# EAGLE design SmartEVSEv2.2 (EAGLE 6.6.0)
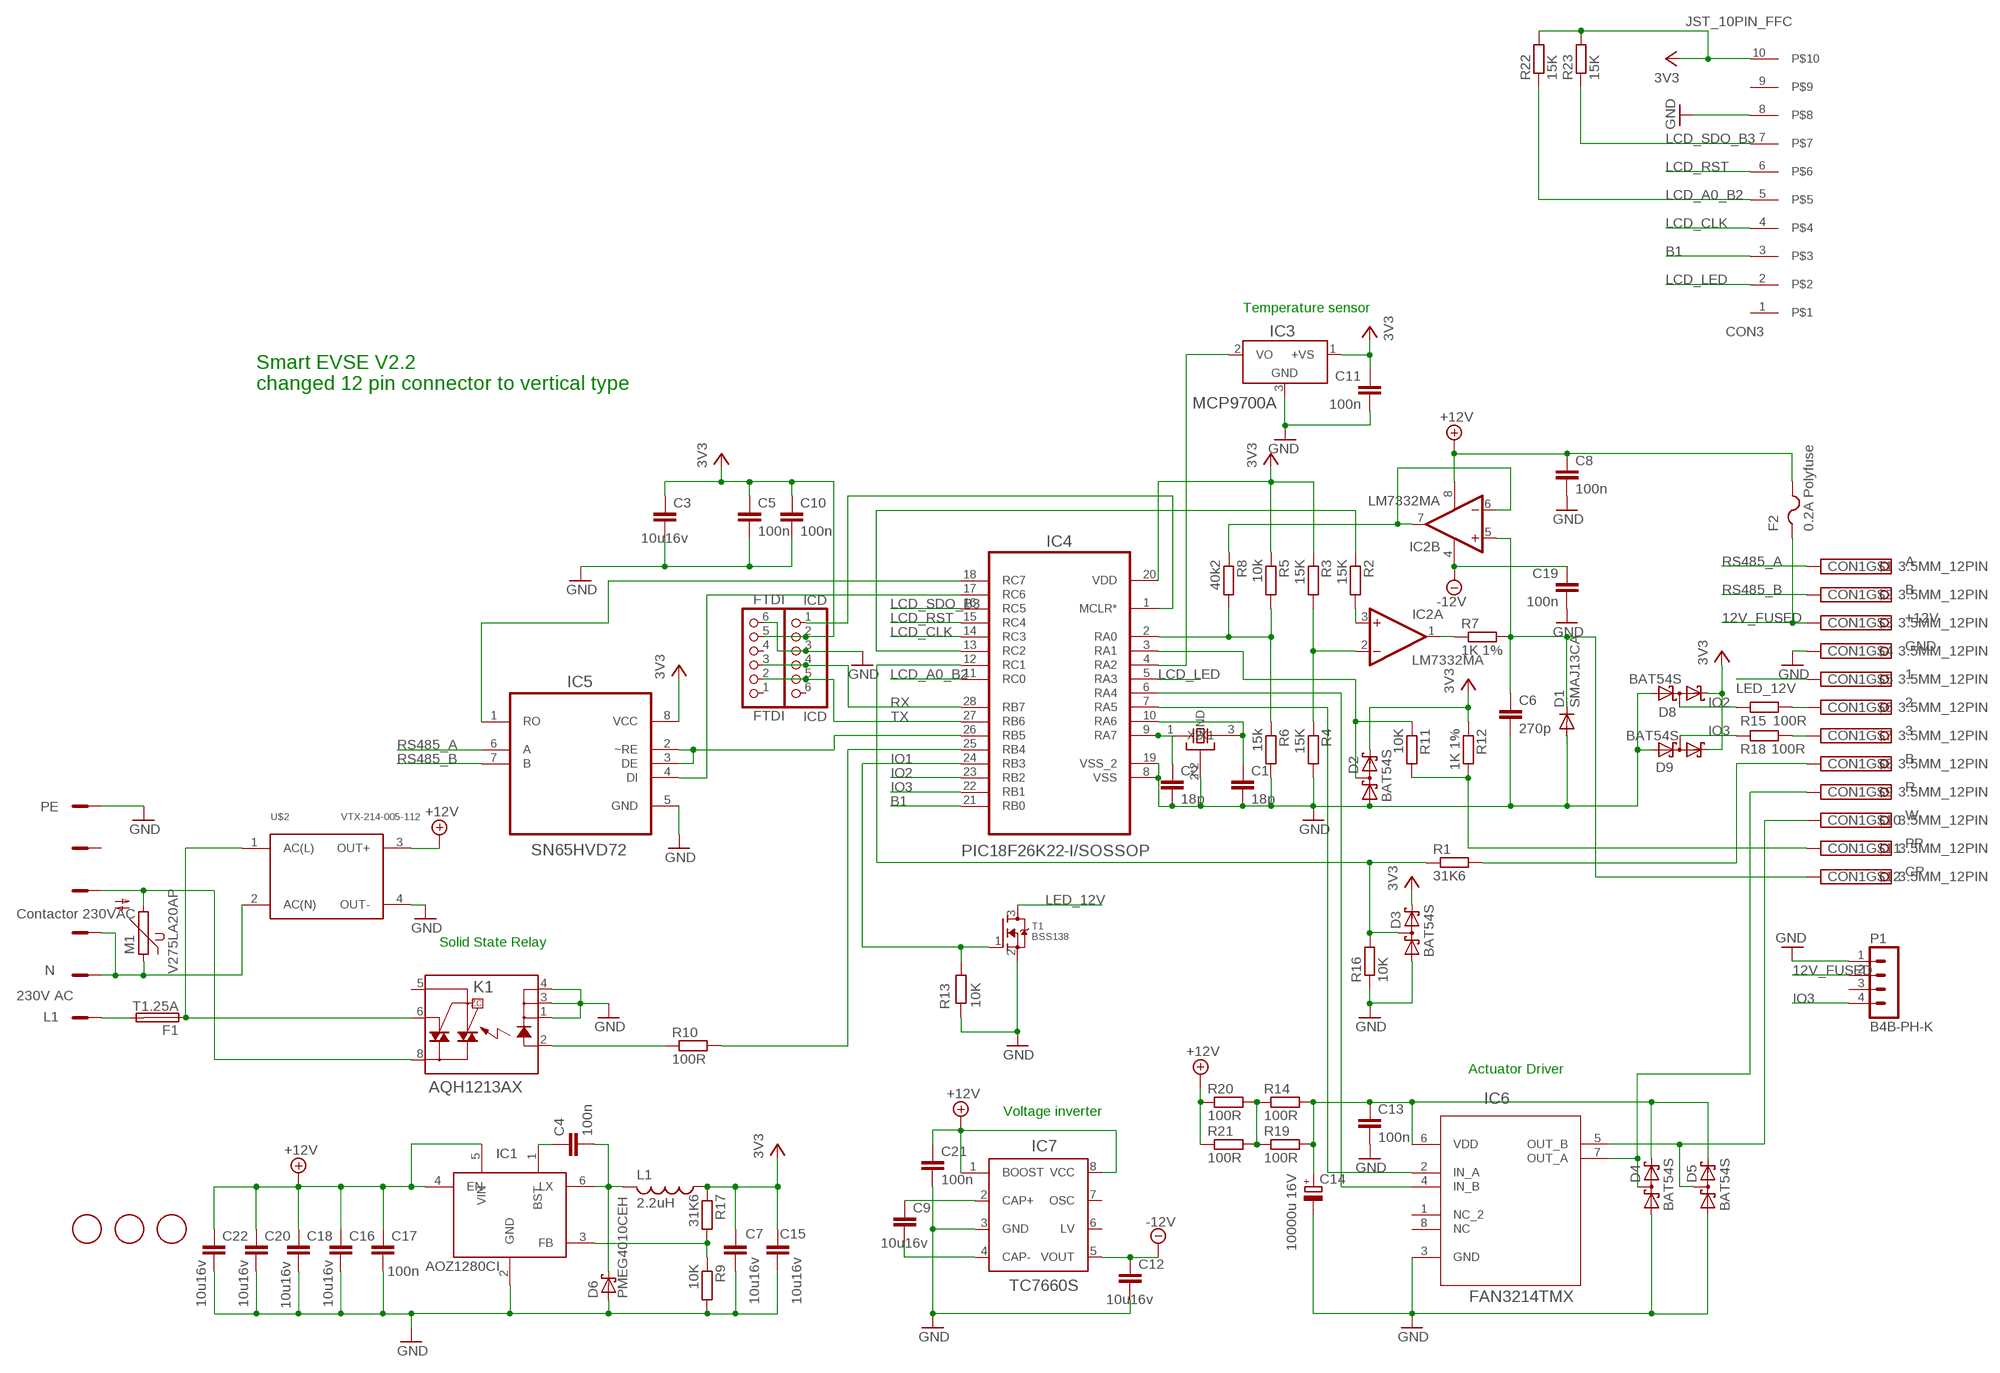
[diagram p0: schematic, sheet 1]

## Parts
C1  18p  C-EUC0603  [C0603]
C2  18p  C-EUC0603  [C0603]
C3  10u16v  C-EUC0805  [C0805]
C4  100n  C-EUC0603  [C0603]
C5  100n  C-EUC0603  [C0603]
C6  270p  C-EUC0805  [C0805]
C7  10u16v  C-EUC0805  [C0805]
C8  100n  C-EUC0603  [C0603]
C9  10u16v  C-EUC0805  [C0805]
C10  100n  C-EUC0603  [C0603]
C11  100n  C-EUC0603  [C0603]
C12  10u16v  C-EUC0805  [C0805]
C13  100n  C-EUC0603  [C0603]
C14  10000u 16V  CPOL-EUE10-22.5  [EB22,5D]
C15  10u16v  C-EUC0805  [C0805]
C16  10u16v  C-EUC0805  [C0805]
C17  100n  C-EUC0603  [C0603]
C18  10u16v  C-EUC0805  [C0805]
C19  100n  C-EUC0603  [C0603]
C20  10u16v  C-EUC0805  [C0805]
C21  100n  C-EUC0603  [C0603]
C22  10u16v  C-EUC0805  [C0805]
CON1  3.5MM_12PIN  [12PIN]
CON2  DG128-7.5  AST027-06  [P_AST027-06]
CON3  JST_10PIN_FFC  [JST_10PIN_FFC]
D1  SMAJ13CA  DIODE-DO214AC  [DO214AC]
D2  BAT54S  [SOT23]
D3  BAT54S  [SOT23]
D4  BAT54S  [SOT23]
D5  BAT54S  [SOT23]
D6  PMEG4010CEH  [SOD-123FL]
D8  BAT54S  [SOT23]
D9  BAT54S  [SOT23]
F1  T1.25A  FUSETE5  [TE5]
F2  0.2A Polyfuse  PTCFUSE-1210  [R1210]
FTDI  FTDI  PINHD-1X6LOCK  [1X06-BIGLOCK]
IC1  AOZ1280CI  AOZ1280CISOT23  [SOT23-6]
IC2  LM7332MA  LM1458D  [SO08]
IC3  MCP9700A  LM50  [SOT23]
IC4  PIC18F26K22-I/SOSSOP  PIC18F25K22-I/SOSSOP  [SOP65P780X200-28N]
IC5  SN65HVD72  MAX487ECSA+  [SOIC127P600X175-8N]
IC6  FAN3214TMX  TC4424AVOA  [SOIC127P600X175-8N]
IC7  TC7660S  TL7660  [SO08]
ICD  ICD  PINHD-1X6  [1X06]
K1  AQH1213AX  AQH213A  [DIL07SMD]
L1  2.2uH  MCSD43  [MCSD43]
M1  V275LA20AP  S14K40  [S14K40]
P1  B4B-PH-K  [B4B-PH-K]
Q1  CTS_32X25_SMD  [CTS_32X25]
R1  31K6  R-EU_R0603  [R0603]
R2  15K  R-EU_R0603  [R0603]
R3  15K  R-EU_R0603  [R0603]
R4  15K  R-EU_R0603  [R0603]
R5  10k  R-EU_R0603  [R0603]
R6  15k  R-EU_R0603  [R0603]
R7  1K 1%  R-EU_R0603  [R0603]
R8  40k2  R-EU_R0603  [R0603]
R9  10K  R-EU_R0603  [R0603]
R10  100R  R-EU_R0603  [R0603]
R11  10K  R-EU_R0603  [R0603]
R12  1K 1%  R-EU_R0603  [R0603]
R13  10K  R-EU_R0603  [R0603]
R14  100R  R-EU_R0603  [R0603]
R15  100R  R-EU_R0603  [R0603]
R16  10K  R-EU_R0603  [R0603]
R17  31K6  R-EU_R0603  [R0603]
R18  100R  R-EU_R0603  [R0603]
R19  100R  R-EU_R0603  [R0603]
R20  100R  R-EU_R0603  [R0603]
R21  100R  R-EU_R0603  [R0603]
R22  15K  R-EU_R0603  [R0603]
R23  15K  R-EU_R0603  [R0603]
T1  BSS138  MOSFET-NREFLOW  [SOT23]
U$1  FIDUCIAL  [FIDUCIAL_1MM]
U$2  VTX-214-005-112  [VTX-214-005-112]
U$3  FIDUCIAL  [FIDUCIAL_1MM]
U$4  FIDUCIAL  [FIDUCIAL_1MM]

## Nets
12V_FUSED: CON1.3 F2.1 P1.2
+12V: C8.1 C16.1 C17.1 C18.1 C20.1 C21.1 C22.1 F2.2 IC1.4(EN) IC1.5(VIN) IC2.8(P:V+) IC7.1(BOOST) IC7.8(VCC) R20.1 R21.1 U$2.3(OUT+)
-12V: C12.1 C19.1 IC2.4(P:V-) IC7.5(VOUT)
B1: CON3.3 IC4.21(RB0)
GND: C1.2 C2.2 C3.2 C5.2 C6.2 C7.1 C8.2 C10.2 C11.2 C12.2 C13.2 C14.- C15.1 C16.2 C17.2 C18.2 C19.2 C20.2 C21.2 C22.2 CON1.4 CON2.P$6 CON3.8 D1.A D2.1(A1) D3.1(A1) D4.1(A1) D5.1(A1) D6.A D8.1(A1) D9.1(A1) FTDI.6 IC1.2(GND) IC3.3(GND) IC4.8(VSS) IC4.19(VSS_2) IC5.5(GND) IC6.3(GND) IC7.3(GND) ICD.3 K1.1(K) K1.3(K1) K1.4(K2) P1.1 Q1.2(GND) Q1.4(GND) R4.2 R6.2 R9.2 R13.1 R16.1 T1.2(S) U$2.4(OUT-)
IO1: IC4.24(RB3) R13.2 T1.1(G)
IO2: D8.3(C1A2) IC4.23(RB2) R15.1
IO3: D9.3(C1A2) IC4.22(RB1) P1.4 R18.1
LCD_A0_B2: CON3.5 IC4.11(RC0) R22.1
LCD_CLK: CON3.4 IC4.14(RC3)
LCD_LED: CON3.2 IC4.5(RA3)
LCD_RST: CON3.6 IC4.15(RC4)
LCD_SDO_B3: CON3.7 IC4.16(RC5) R23.1
LED_12V: CON1.5 T1.3(D)
N$1: D3.3(C1A2) IC4.12(RC1) R1.1 R16.2
N$2: F1.1 K1.6(DS3) U$2.1(AC(L))
N$3: IC4.6(RA4) IC6.4(IN_B)
N$5: IC4.17(RC6) IC5.4(DI)
N$6: IC4.18(RC7) IC5.1(RO)
N$7: C2.1 IC4.9(RA7) Q1.1(X1)
N$8: C1.1 IC4.10(RA6) Q1.3(X2)
N$9: IC2.2(A:-IN) R3.2 R4.1
N$10: C6.1 CON1.12 D1.C IC2.5(B:+IN) R7.2
N$11: IC4.13(RC2) R2.1
N$12: IC2.3(A:+IN) R2.2
N$13: IC4.2(RA0) R5.2 R6.1 R8.2
N$14: IC2.1(A:OUT) R7.1
N$15: IC2.6(B:-IN) IC2.7(B:OUT) R8.1
N$16: D2.3(C1A2) IC4.3(RA1) R11.1
N$17: C13.1 C14.+ D4.2(C2) D5.2(C2) IC6.6(VDD) R14.2 R19.2
N$18: IC4.7(RA5) IC6.2(IN_A)
N$19: K1.2(A) R10.1
N$20: IC4.25(RB4) R10.2
N$21: CON2.P$1 F1.2
N$22: CON1.11 R11.2 R12.2
N$23: CON2.P$4 K1.8(DS1) M1.2
N$25: IC4.26(RB5) IC5.2(~RE) IC5.3(DE)
N$26: CON2.P$2 CON2.P$3 M1.1 U$2.2(AC(N))
N$27: CON1.9 D4.3(C1A2) IC6.7(OUT_A)
N$28: IC4.1(MCLR*) ICD.1
N$29: CON1.10 D5.3(C1A2) IC6.5(OUT_B)
N$30: C4.1 IC1.1(BST)
N$32: R14.1 R19.1 R20.2 R21.2
N$33: CON1.8 R1.2
N$34: CON1.6 R15.2
N$35: CON1.7 R18.2
N$36: C9.1 IC7.2(CAP+)
N$37: IC3.2(VO) IC4.4(RA2)
N$38: C9.2 IC7.4(CAP-)
N$40: IC1.3(FB) R9.1 R17.2
N$41: C4.2 D6.C IC1.6(LX) L1.2
RS485_A: CON1.1 IC5.6(A)
RS485_B: CON1.2 IC5.7(B)
RX: FTDI.3 IC4.28(RB7) ICD.4
TX: FTDI.2 IC4.27(RB6) ICD.5
VCC: C3.1 C5.1 C7.2 C10.1 C11.1 C15.2 CON3.10 D2.2(C2) D3.2(C2) D8.2(C2) D9.2(C2) FTDI.5 IC3.1(+VS) IC4.20(VDD) IC5.8(VCC) ICD.2 L1.1 R3.1 R5.1 R12.1 R17.1 R22.2 R23.2 ; supply symbol labelled 3V3
Unconnected: CON2.P$5 CON3.1 CON3.9 FTDI.1 FTDI.4 IC6.1(NC_2) IC6.8(NC) IC7.6(LV) IC7.7(OSC) ICD.6 K1.5(DS2) P1.3

## Notes on the sheet
- Temperature sensor
- Smart EVSE V2.2 
  changed 12 pin connector to vertical type
- A
- B
- +12V
- GND
- 1
- 2
- 3
- B
- R
- PE
- W
- PP
- CP
- Contactor 230VAC
- Solid State Relay
- N
- 230V AC
- L1
- Actuator Driver
- Voltage inverter

## Library data of the parts
C1-C13 C15-C22 = rcl:C-EU: CAPACITOR, European symbol
C14 = rcl:CPOL-EU: POLARIZED CAPACITOR, European symbol
CON1 = con-phoenix-350:3.5MM_12PIN
CON2 = con-ria-ast027-750:AST027-06: RIA Springcon AST027-06 Grid 7,5mm Source: http://www.riaconnect.com/_assets/catalog/2008_TB_40.pdf
CON3 = Traco-TMLM04:JST_10PIN_FFC
D1 = diode:DIODE-: DIODE
D2-D5 D8 D9 = diode:BAT54S: Schottky Diodes Pin connection corrected 2011-05-04 Source: Fairchild .. BAT54.pdf
D6 = adafruit:PMEG4010CEH
F1 = fuse:FUSE: Fuse; OC_FARNELL: unknown; OC_NEWARK: unknown
F2 = adafruit:PTCFUSE: PTC fuses, resettable thermistors
FTDI = adafruit:PINHD-1X6: PIN HEADER
IC1 = adafruit:AOZ1280CI
IC2 = linear:*1458: OP AMP
IC3 = linear:LM50: SOT-23 Single-Supply Centigrade Temperature Sensor Vout = (10mV/°C x Temp °C) +5mmmV Source: http://cache.national.com/ds/LM/LM50.pdf
IC4 = pic_18f25k22:PIC18F25K22-I/SO: MCU 8BIT 32KB FLASH 5.5V 28SOIC
IC5 = max487:MAX487ECSA+: Low-Power, Slew-Rate-Limited RS-485/RS-422 Transceivers; MPN: MAX487ECSA+; OC_FARNELL: 9724532; OC_NEWARK: 68K4803; PACKAGE: SOIC-8; SUPPLIER: Maxim
IC6 = tc4424:TC4424AVOA: 3A Dual High-Speed Power MOSFET Drivers; DESCRIPTION: MOSFET; MPN: TC4424AVOA; OC_FARNELL: 1332307; OC_NEWARK: 56K7421; PACKAGE: SOIC-8; SUPPLIER: Microchip
IC7 = texas:TL7660: CMOS VOLTAGE CONVERTER Source: http://focus.ti.com/lit/ds/scas794/scas794.pdf
ICD = pinhead:PINHD-1X6: PIN HEADER
K1 = relay:AQH*213: SOLID STATE RELAY NAiS Source: http://www.mew-europe.com/.. en_ds_61613_0000.pdf; OC_FARNELL: unknown; OC_NEWARK: unknown
L1 = rcl:MCSD43: INDUCTOR MCSD43
M1 = varistor:S14K40: VARISTOR
P1 = con-jst-ph:B4B-PH-K: HEADER
Q1 = cts_crystal:CTS_32X25_SMD
R1-R23 = resistor:R-EU_: RESISTOR, European symbol
T1 = adafruit:MOSFET-N: N-Channel Mosfet 2N7002E - 60V 260mA SOT23 [Digikey: 2N7002ET1GOSTR-ND] - REEL BSH103 - 30V 850mA SOT23 [Digikey: 568-5013-1-ND]
U$1 U$3 U$4 = adafruit:FIDUCIAL: For use by pick and place machines to calibrate the vision/machine, 1mm By microbuilder.eu
U$2 = Traco-TMLM04:VTX-214-005-112

## Board
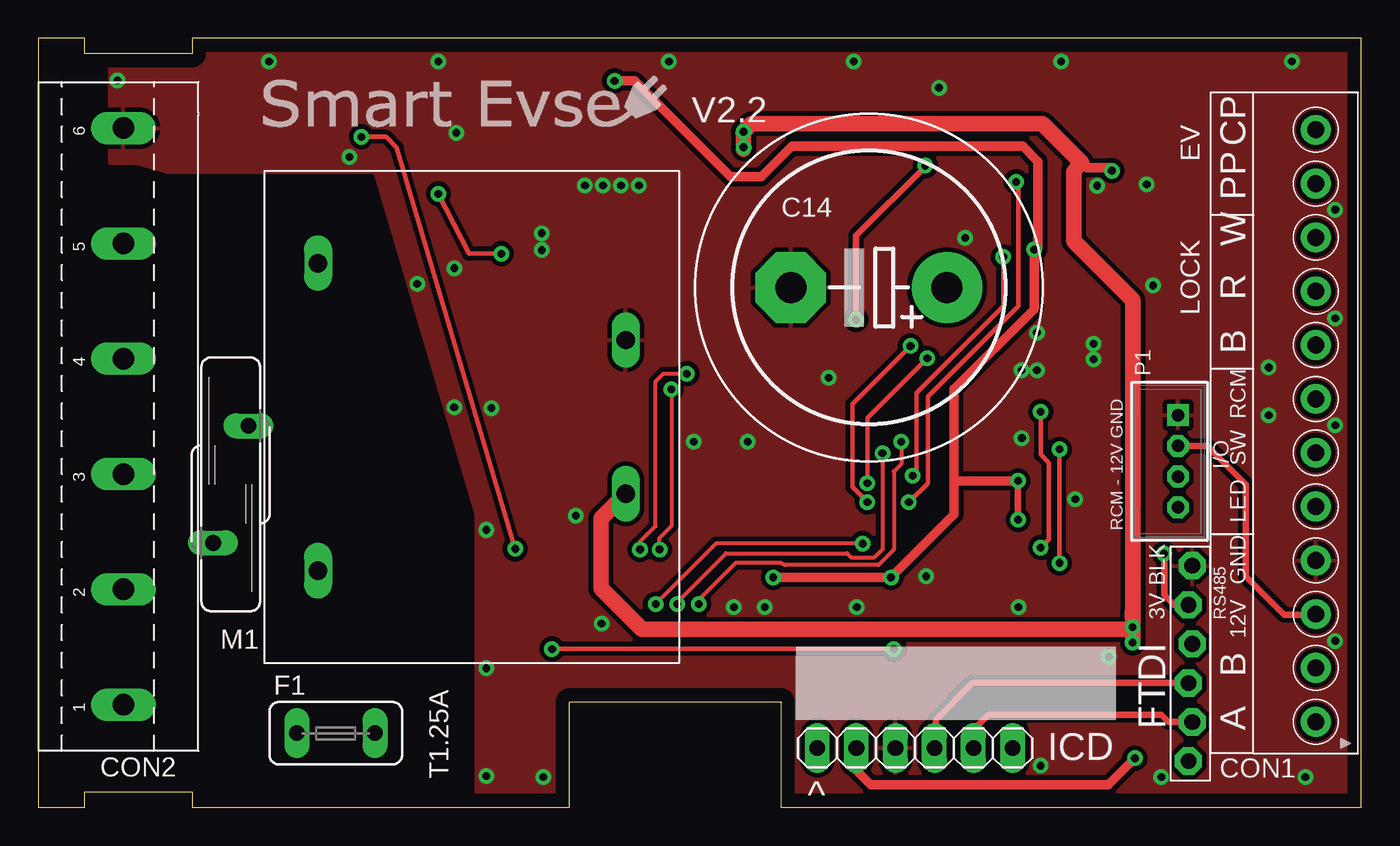
[diagram p1: board, top side]
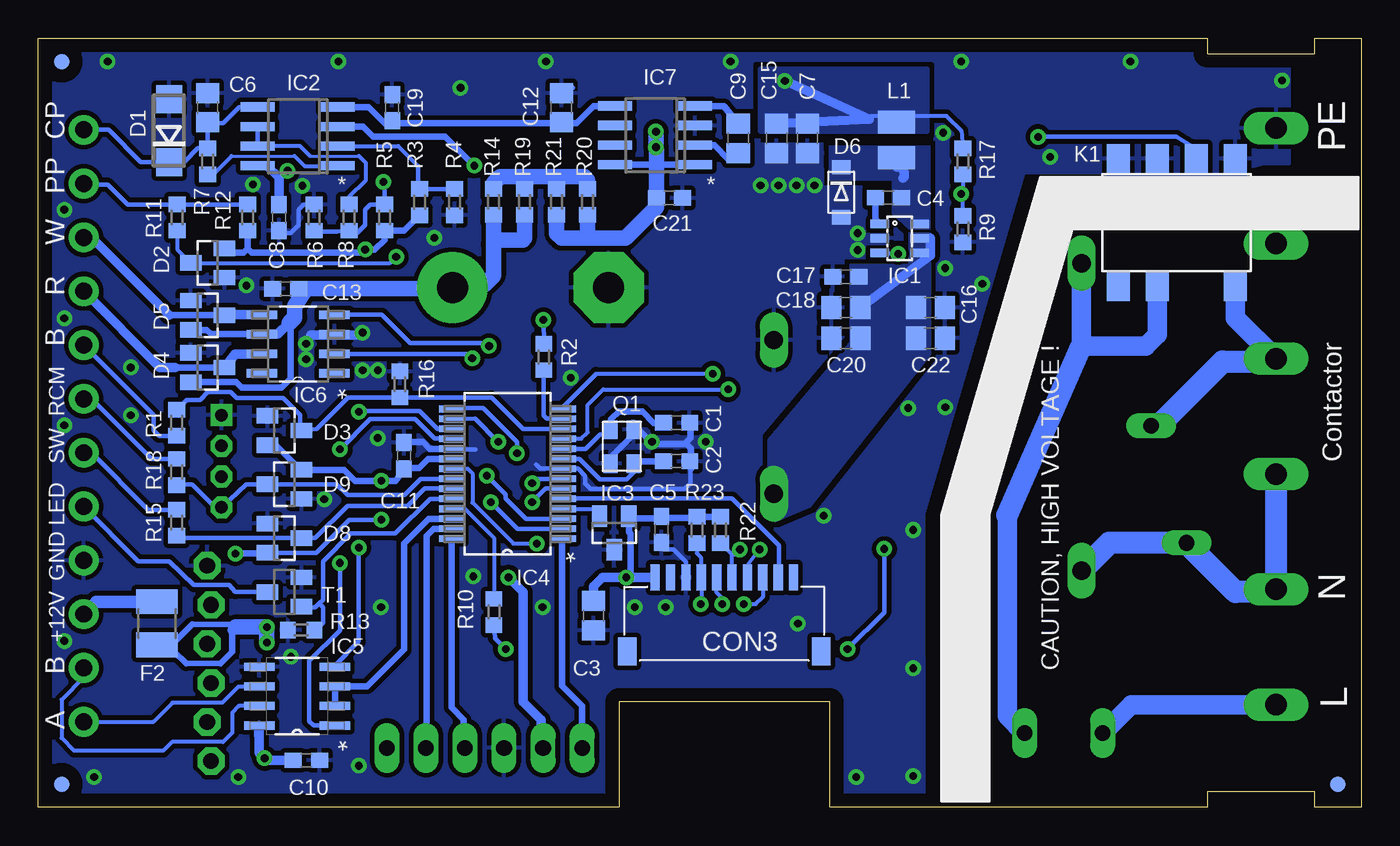
[diagram p2: board, bottom side, seen from below]

Size 86 x 50 mm. Coordinates in mm from the lower left corner, seen from the top.
Outline: 0,0 3,0 3,1 10,1 10,0 34.55,0 34.55,6.84 48.27,6.84 48.27,0 86,0 86,50 10,50 10,49 3,49 3,50 0,50 0,0
Copper layers (1*16): Top 0.035mm / dielectric 1.5mm / Bottom 0.035mm
Design rules "default *": minimum track width 10mil, minimum drill 0.5mm, track to track 8mil, track to pad 8mil, pad to pad 7mil, via to via 8mil, smd to smd 5mil, copper to edge 35mil, drill to drill 8mil, minimum pad ring 12mil, minimum via ring 10mil, stop-mask expansion 4mil, vias tented up to drill 20mil, thermal gap 12mil

### Footprints (pad centres in the part's own frame; a part is rotated, then mirrored left to right if it is on the bottom)
C0603 = smd 1.1 x 1: 1 -0.85,0; 2 0.85,0
C0805 = smd 1.3 x 1.5: 1 -0.95,0; 2 0.95,0
EB22,5D = drill 2.007 pad 4.597: + -5.08,0 | drill 2.007 pad 4.597 octagon: - 5.08,0
12PIN = drill 1.1 pad 1.93: 1 -18.942,-0.56; 2 -15.443,-0.56; 3 -11.943,-0.56; 4 -8.443,-0.56; 5 -4.942,-0.56; 6 -1.442,-0.56; 7 2.058,-0.56; 8 5.558,-0.56; 9 9.057,-0.56; 10 12.557,-0.56; 11 16.058,-0.56; 12 19.558,-0.56
P_AST027-06 = drill 1.4 long: P$1 -19.05,0; P$2 -11.55,0; P$3 -4.05,0; P$4 3.45,0; P$5 10.95,0; P$6 18.45,0
JST_10PIN_FFC = smd 0.6 x 1.7: 1 -4.5,-3; 2 -3.5,-3; 3 -2.5,-3; 4 -1.5,-3; 5 -0.5,-3; 6 0.5,-3; 7 1.5,-3; 8 2.5,-3; 9 3.5,-3; 10 4.5,-3 | smd 1.2 x 1.8: 11 6.3,1.8; 13 -6.3,1.8
DO214AC = smd 1.8 x 1.7: A 2.05,0; C -2.05,0
SOT23 = smd 1 x 1.4: 1 -0.95,-1.1; 2 0.95,-1.1; 3 0,1.1
SOD-123FL = smd 0.91 x 1.22: A 1.637,0; C -1.637,0
TE5 = drill 1.016 long: 1 -2.54,0; 2 2.54,0
R1210 = smd 1.6 x 2.7: 1 -1.4,0; 2 1.4,0
1X06-BIGLOCK = drill 1.016 pad 1.778 octagon: 1 -6.35,0.127; 2 -3.81,-0.127; 3 -1.27,0.127; 4 1.27,-0.127; 5 3.81,0.127; 6 6.35,-0.127
SOT23-6 = smd 0.55 x 1.2: 1 -0.95,-1.3; 2 0,-1.3; 3 0.95,-1.3; 4 0.95,1.3; 5 0,1.3; 6 -0.95,1.3
SO08 = smd 0.6 x 2.2: 1 -1.905,-2.6; 2 -0.635,-2.6; 3 0.635,-2.6; 4 1.905,-2.6; 5 1.905,2.6; 6 0.635,2.6; 7 -0.635,2.6; 8 -1.905,2.6
SOP65P780X200-28N = smd 1.651 x 0.432: 1 -3.632,4.216; 2 -3.632,3.581; 3 -3.632,2.921; 4 -3.632,2.286; 5 -3.632,1.626; 6 -3.632,0.965; 7 -3.632,0.33; 8 -3.632,-0.33; 9 -3.632,-0.965; 10 -3.632,-1.626; 11 -3.632,-2.286; 12 -3.632,-2.921; 13 -3.632,-3.581; 14 -3.632,-4.216; 15 3.632,-4.216; 16 3.632,-3.581; 17 3.632,-2.921; 18 3.632,-2.286; 19 3.632,-1.626; 20 3.632,-0.965; 21 3.632,-0.33; 22 3.632,0.33; 23 3.632,0.965; 24 3.632,1.626; 25 3.632,2.286; 26 3.632,2.921; 27 3.632,3.581; 28 3.632,4.216
SOIC127P600X175-8N = smd 1.981 x 0.533: 1 -2.464,1.905; 2 -2.464,0.635; 3 -2.464,-0.635; 4 -2.464,-1.905; 5 2.464,-1.905; 6 2.464,-0.635; 7 2.464,0.635; 8 2.464,1.905
SOIC127P600X175-8N' = smd 1.981 x 0.559: 1 -2.362,1.905; 2 -2.362,0.635; 3 -2.362,-0.635; 4 -2.362,-1.905; 5 2.362,-1.905; 6 2.362,-0.635; 7 2.362,0.635; 8 2.362,1.905
1X06 = drill 1.016 long: 1 -6.35,0; 2 -3.81,0; 3 -1.27,0; 4 1.27,0; 5 3.81,0; 6 6.35,0
DIL07SMD = smd 1.5 x 1.9: 1 -3.81,-4.15; 2 -1.27,-4.15; 3 1.27,-4.15; 4 3.81,-4.15; 5 3.81,4.15; 6 1.27,4.15; 8 -3.81,4.15
MCSD43 = smd 1.5 x 2.4: 1 -1.15,0; 2 1.15,0
S14K40 = drill 1.016 long: 1 -1.143,-3.81; 2 1.143,3.81
B4B-PH-K = drill 0.813 square: 1 -3,0 | drill 0.813 octagon: 2 -1,0; 3 1,0; 4 3,0
CTS_32X25 = smd 1.2 x 0.9: 1 -1.1,-0.7; 2 1.1,-0.7; 3 1.1,0.8; 4 -1.1,0.8
R0603 = smd 1 x 1.1: 1 -0.85,0; 2 0.85,0
FIDUCIAL_1MM = smd 1 x 1: 1 0,0
VTX-214-005-112 = drill 1.2 long: 1 10,10; 2 -10,10; 3 -5,-10; 4 5,-10

### Placement (x,y rotation side)
C1  44.5,25 0 bottom
C2  44.5,22.5 0 bottom
C3  49.91,12.45 270 bottom
C4  30.73,39.65 0 bottom
C5  45.49,18.06 270 bottom
C6  75,45.5 90 bottom
C7  36,43.5 90 bottom
C8  70.36,38.35 270 bottom
C9  40.5,43.5 90 bottom
C10  68.58,3.05 0 bottom
C11  62.23,22.86 90 bottom
C12  52,45.5 90 bottom
C13  69.92,33.72 180 bottom
C14  54,33.8 180 top
C15  38,43.5 90 bottom
C16  28,32.5 0 bottom
C17  33.5,34.5 180 bottom
C18  33.5,32.5 180 bottom
C19  63,45.5 90 bottom
C20  33.5,30.5 180 bottom
C21  44.96,39.62 0 bottom
C22  28,30.5 0 bottom
CON1  82.5,24.5 90 top
CON2  5.52,25.72 90 top
CON3  41.4,11.94 180 bottom
D1  77.5,44 90 bottom
D2  75,35.4 90 bottom
D3  70,24.5 270 bottom
D4  75,28.6 270 bottom
D5  75,32 270 bottom
D6  33.8,40 270 bottom
D8  70,17.5 270 bottom
D9  70,21 90 bottom
F1  19.34,4.81 180 top
F2  78.3,11.96 270 bottom
FTDI  74.9,9.35 90 top
IC1  30,37 270 bottom
IC2  69.14,43.63 90 bottom
IC3  48.56,17.84 180 bottom
IC4  55.51,21.68 180 bottom
IC5  69.17,7.22 180 bottom
IC6  FAN3214TMX  [SOIC127P600X175-8N']  69.11,30.12 180 bottom
IC7  45.9,43.7 90 bottom
ICD  56.99,3.85 0 top
K1  11.98,38.02 180 bottom
L1  30.21,43.4 270 bottom
M1  12.5,21 0 top
P1  74.1,22.5 270 top
Q1  48,23.45 90 bottom
R1  77,25 270 bottom
R2  53.14,29.29 90 bottom
R3  61.21,39.35 90 bottom
R4  58.93,39.35 270 bottom
R5  63.5,38.35 90 bottom
R6  68.07,38.35 90 bottom
R7  75,42 90 bottom
R8  65.79,38.35 270 bottom
R9  25.9,37.6 270 bottom
R10  56.39,12.7 90 bottom
R11  76.98,38.35 90 bottom
R12  72.39,38.35 90 bottom
R13  68.92,11.52 0 bottom
R14  56.42,39.37 270 bottom
R15  77,18.5 90 bottom
R16  62.5,27.5 270 bottom
R17  25.9,42 270 bottom
R18  77,21.8 90 bottom
R19  54.39,39.37 270 bottom
R20  50.28,39.38 90 bottom
R21  52.31,39.38 90 bottom
R22  41.66,18.03 90 bottom
R23  43.18,18.03 90 bottom
T1  70,14 90 bottom
U$1  1.5,1.5 0 bottom
U$2  28.18,25.38 90 top
U$3  84.5,1.5 0 bottom
U$4  84.5,48.5 0 bottom

### Tracks (layer width: path | path; a pad name or v marks a point on that pad's centre or on a via)
12V_FUSED
  Top 0.406: P1.2 76,23.5 78.5,21 78.5,15 81,12.5 83,12.5 CON1.3
  Bottom 0.813: F2.1 82.25,13.36 CON1.3
+12V  (via drill 0.5)
  Top 0.305: v45.85,43.94 v45.85,42.93
  Top 0.406: 68.13,41.6 67.83,41.9
  Top 0.61: 68.13,41.6 69.6,41.6 v69.8,41.4
  Top 1.016: v71.15,11.72 v71.15,10.7 | v71.15,11.72 71.15,32.99 67.31,36.83 67.31,41.34 67.74,41.9 67.83,41.9 65.28,44.45 46.35,44.45 v45.85,43.94 | 45.81,43.85 45.85,43.81 v45.85,42.93 45.85,42.8 | 71.14,12.7 v71.15,11.72 | U$2.3 36.58,18.78 36.58,14.22 39.24,11.56 70.99,11.56 v71.15,11.72
  Bottom 0.35: 74.15,9.35 76.4,9.35 | 76,11.89 73.61,11.89
  Bottom 0.406: IC7.8 45.81,41.8 IC7.1 44.73,41.8 | 70.36,40.94 v69.8,41.4 | 76,11.89 77.75,10.15 | 77.75,10.15 77.2,10.15 76.4,9.35 | 74.15,9.35 73.4,10.1 73.4,11.5 | 77.75,10.15 78.3,10.15 F2.2
  Bottom 0.61: IC2.8 71.15,41.73 70.36,40.94 C8.1 | 28,37 28,36 | 28,36 28,35.88 C18.1 | 28.05,36.05 28,36 | 73.18,11.72 73.4,11.5
  Bottom 1.016: C21.1 45.81,41.8 v45.85,43.94 | C21.1 45.81,39.02 47.84,37 50,37 | C21.1 | v71.15,10.7 v71.15,11.72 73.18,11.72 | R21.1 52.31,37.31 52,37 50,37 | R20.1 50.28,37.28 50,37
  pour Bottom (no thermals): 35.81,19.54 27.97,29.45 27.97,37.34 29.43,37.36 29.44,35.31 33.27,35.31 33.27,30.23 38.61,23.88 38.61,19.05 38.1,18.54
-12V
  Bottom 0.406: 63.02,44.84 C19.1 | IC2.4 64.54,45.54 63.5,44.5 63.2,44.8 63.2,45 C19.1 | IC7.5 49.9,45.6 51,44.5 51.95,44.5 C12.1 52.05,44.5 62.85,44.5 C19.1
B1  (via drill 0.5)
  Top 0.254: v53.59,17.14 44.07,17.14 v40.13,13.21
  Bottom 0.254: IC4.21 58.08,22.02 57.78,21.72 57.78,19.81 55.12,17.14 v53.59,17.14 | CON3.3 38.9,13.68 39.37,13.21 v40.13,13.21
GND  (via drill 0.5)
  Bottom 0.305: 51.26,46.8 C12.2 | 57.58,23.27 59.1,23.27 IC4.19 | C2.2 43.61,21.84 43.61,21.07 43.98,20.7 50.1,20.7 50.47,21.07 50.47,21.56 50.92,22.02 IC4.8 53.38,22.02 53.66,22.3 | R6.2 68.75,39.2 69.09,38.86 69.09,37.85 69.6,37.34 70.29,37.34 C8.2 | CON3.8 43.9,15.96 44.7,16.76 45.34,16.76 C5.2
  Bottom 0.406: IC4.19 60.55,23.31 61.01,23.77 61.94,23.77 C11.2 | 43.98,23.64 46.06,23.64 46.98,24.55 Q1.2 47.53,24.33 47.53,24.01 48.8,22.74 Q1.4 | 43.98,23.64 43.61,24.01 43.61,25.26 C1.2 | 43.98,23.64 43.86,23.64 43.56,23.34 43.56,22.01 C2.2
  Bottom 0.61: 68.3,30.7 65.3,30.7
  other vias: 60.26,37.04 58.55,46.8 32.83,1.96 29.12,18.03 5.14,47.27 15,48.5 29.44,25.96 53,48.5 42.61,23.77 72.06,40.52 68.84,40.42 64.92,30.87 68.6,30.14 63.95,24.01 80,28.6 80,25.5 65.17,2.69 73.01,1.96 82.38,1.96 84.32,10.81 81.5,48.5 84.32,38.86 84.32,31.8 84.32,24.85 69.59,9.78 66.5,48.5 64.92,28.42 51.38,27.93 24.62,34.04 20.22,42.3 26,48.5 35.54,40.44 36.71,40.44 37.88,40.44 39.05,40.44 27.03,26 45.22,13.01 32.74,37.34 32.74,36.24 46.11,23.77 36.62,11.93 47.22,13.01 68.6,29.14 63.92,28.42 29.12,9.03 29.12,2.03 67.42,20.02 27.16,43.87 27.04,35.06 53.22,13.01 57.72,15.01 63.72,13.01 72.48,33.93 34.94,18.96 41,48.5
  pour Bottom (isolate 0.305, rank 2): 4.66,49.49 85.5,49.49 85.5,0.49 28.43,0.49 28.46,19.05 21.92,41.29 8.47,41.29 6.37,41.9 4.66,41.9
  pour Top (isolate 0.305, rank 2): 4.66,49.49 85.5,49.49 85.5,0.49 28.47,0.49 28.47,19.07 21.92,41.29 8.38,41.29 6.37,41.9 4.66,41.9
  pour Bottom (no thermals): 30.7,37.3 32.7,37.3 32.7,39.6 35.2,39.6 35.2,36.6 30.7,36.6
  pour Bottom (no thermals): 35,41.5 35,43.2 39.3,43.2 39.3,41.5
IO1
  Bottom 0.305: 67.75,13.25 67.5,13.5 67.5,16 65.7,17.8 62.8,17.8 60.54,20.06 IC4.24 | 67.75,13.25 68,13 68.85,13 T1.1 | R13.2 67.98,11.52 67.5,12 67.5,13 67.75,13.25
IO2
  Bottom 0.305: IC4.23 60.88,20.72 61.99,19.6 65.9,19.6 68,17.5 D8.3 76.85,17.5 R15.1 76.85,18
IO3
  Bottom 0.305: IC4.22 61.15,21.36 62.2,20.3 65.9,20.3 66.6,21 D9.3 72.5,21 P1.4 74.5,19.5 76,21 76.95,21 R18.1
LCD_A0_B2  (via drill 0.5)
  Top 0.254: v41.15,27.18 41.15,18.29 40.39,17.53 v40.39,16.76
  Bottom 0.254: CON3.5 40.9,16.43 | 40.9,16.43 R22.1 | IC4.11 50.7,23.97 50.29,24.38 50.29,26.16 49.28,27.18 v41.15,27.18 | 40.9,16.43 40.72,16.43 v40.39,16.76
LCD_CLK  (via drill 0.5)
  Top 0.254: v42.16,28.19 40.64,28.19 40.13,27.69 40.13,18.29 39.12,17.27 v39.12,16.76
  Top 0.305: 42.14,28.17 v42.16,28.19
  Bottom 0.254: CON3.4 39.9,15.72 v39.12,16.76
  Bottom 0.305: IC4.14 51.87,26.04 49.73,28.18 v42.16,28.19
LCD_LED
  Bottom 0.254: IC4.5
  Bottom 0.305: IC4.5 40.89,20.07 37.85,17.02 37.85,14.99 CON3.2
LCD_RST  (via drill 0.5)
  Top 0.254: v54.88,23.03 54.88,16.78 54.36,16.26 52.83,16.26 52.58,16.51 44.7,16.51 41.53,13.34 v41.53,13.21
  Bottom 0.254: v41.53,13.21 41.53,13.59 41.91,13.97 CON3.6
  Bottom 0.305: v54.88,23.03 54.88,23.77 57.09,25.97 59.07,25.97 IC4.15
LCD_SDO_B3  (via drill 0.5)
  Top 0.254: v56.1,23.77 56.1,22.32 55.63,21.84 55.63,16.76 54.61,15.75 48.51,15.75 48.26,15.88 45.31,15.88 42.9,13.46 42.9,13.23 v42.93,13.21
  Bottom 0.254: R23.1 43.18,16.51 42.93,16.26 42.93,14.96 CON3.7 42.9,13.23 v42.93,13.21 | IC4.16 57.61,25.27
  Bottom 0.305: 57.61,25.27 v56.1,23.77
LED_12V
  Bottom 0.305: CON1.5 79.5,16 77.5,16 75.9,14.45 73.6,14.45 73.2,14 T1.3
N$1
  Bottom 0.305: IC4.12 54.49,24.6 56.54,26.65 R16.2 | 62.35,26.8 R16.2 | R16.2 65.85,26.65 67.9,24.6 D3.3 69,24.7 69,25.5 70.1,26.6 73.1,26.6 73.5,27 75,27 75.5,26.5 76.35,26.5 R1.1
  Bottom 0.406: IC4.12
N$2
  Bottom 1.27: U$2.1 18.18,30 14,30 13.26,30.75 K1.6 | 23,19 23,5.94 F1.1
  Bottom 1.422: 23,19 18.18,30
N$3  (via drill 0.5)
  Top 0.305: v53.9,19.84 52.92,20.82 52.92,26.22 v56.7,30
  Bottom 0.305: IC4.6 53.02,20.72 v53.9,19.84 | IC6.4 63.67,32.03 61.83,30.18 57.18,30.18 v56.7,30
N$5  (via drill 0.5)
  Top 0.305: v65.17,25.73 65.17,22.93 65.7,22.4 65.7,17.41 v65.17,16.89
  Bottom 0.305: IC5.4 66.71,9.24 65.17,10.78 v65.17,16.89 | IC4.17 60.04,24.61 61.21,25.78 65.11,25.78 v65.17,25.73
N$6  (via drill 0.5)
  Top 0.305: v66.39,15.88 v66.39,23.27
  Bottom 0.305: IC4.18 60.23,23.97 61.49,25.23 64.44,25.23 v66.39,23.27 | v66.39,15.88 66.39,11.52 68.4,9.51 68.4,5.6 68.11,5.32 IC5.1
N$7
  Bottom 0.305: 47.28,22.34 47.28,21.8 47.77,21.32 49.49,21.32 50.83,22.65 IC4.9
  Bottom 0.406: 47.28,22.34 Q1.1 47.16,22.5 C2.1
N$8
  Bottom 0.305: IC4.10 50.43,23.31 49.49,24.25 49.1,24.25 Q1.3
  Bottom 0.406: 48.86,24.5 Q1.3 48.76,24.6 48.76,25.23 48.27,25.73 46.73,25.73 46,25 C1.1
N$9
  Bottom 0.254: IC2.2 62.6,43 61.3,41.7
  Bottom 0.305: R4.1 60.51,40.19 R3.2 61.3,40.29 61.3,41.7
N$10
  Bottom 0.305: CON1.12 81.44,44.06 79.34,41.95 D1.C 77.45,42 76.5,42 75.65,42.85 R7.2 C6.1 74.95,44.5 74,44.5 72.96,45.54 IC2.5
  Bottom 0.406: 77.45,42.38 D1.C
N$11
  Bottom 0.305: IC4.13 52.95,25.27 53.16,25.48 53.16,28.41 R2.1
N$12  (via drill 0.5)
  Top 0.305: v57.66,41.73 57.66,41.66
  Top 0.406: 57.66,41.66 53.16,37.16 v53.16,31.7
  Bottom 0.305: v53.16,31.7 53.16,31.66 R2.2
  Bottom 0.406: IC2.3 64.89,44.27 64.23,43.61 59.54,43.61 v57.66,41.73
N$13  (via drill 0.5)
  Top 0.305: v56.59,19.84 57.82,21.07 57.82,26.7 63.72,32.6 63.72,40.52 v63.57,40.68
  Bottom 0.305: IC4.2 54.85,18.1 v56.59,19.84 | R6.1 68.01,37.45 66.58,37.45 R8.2 65.62,37.34 65.28,37.34 64.77,37.85 64.77,38.86 64.43,39.2 R5.2 63.5,40.61 v63.57,40.68
N$14
  Bottom 0.2: 73.45,42.35 69.35,42.35
  Bottom 0.254: 69.35,42.35 68.7,41.7 66.58,41.7 IC2.1 | R7.1 74.65,41.15 73.45,42.35
N$15
  Bottom 0.2: 68.35,42.35 65.15,42.35
  Bottom 0.254: R8.1 65.79,39.71 64.7,40.8 64.7,41.9 65.15,42.35 | IC2.7 69,43 68.35,42.35
  Bottom 0.305: IC2.7 IC2.6
N$16  (via drill 0.5)
  Top 0.305: v56.84,21.56 57.09,21.8 57.09,26.95 62.74,32.6 v62.74,35.79
  Bottom 0.254: v62.74,35.79 63.13,35.4 D2.3 76.98,36.28 R11.1
  Bottom 0.305: IC4.3 54.29,18.76 55.62,20.09 55.62,20.34 v56.84,21.56 | v62.74,35.79 62.91,35.79 | 76,35.3 D2.3
N$17
  Bottom 0.305: 68.6,33.72 68.97,33.72 C13.1
  Bottom 0.406: 69.7,31.5 69.58,31.38 69.61,31.34 69.61,27.89 70.2,27.3 72.8,27.3 73.15,27.65 D4.2 | IC6.6 74.76,30.76 75.05,31.05 D5.2
  Bottom 0.61: IC6.6 70.44,30.76 69.71,31.49
  Bottom 0.813: 69.71,31.49 69.7,31.5
  Bottom 1.016: 69.7,31.5 69.69,31.5 69.33,31.85 69.33,32.59 68.6,33.72 59.56,33.72 C14.+ 58.88,34 57,34 56.42,34.58 56.42,36.6 | R14.2 56.42,36.6 | R19.2 54.39,37.01 54.5,36.9 56.12,36.9 56.42,36.6
N$18  (via drill 0.5)
  Top 0.305: v53.9,21.07 53.9,25.3 v57.8,29.2
  Bottom 0.305: IC4.7 53.86,21.36 v53.9,21.07 | IC6.2 58.09,29.49 v57.8,29.2
N$19  (via drill 0.5)
  Top 0.305: v55.62,10.29 v33.39,10.29 | v31,16.8 23.3,42.9 22.6,43.6 v21,43.6
  Bottom 0.305: R10.1 56.32,10.99 v55.62,10.29 | 33.4,10.3 v33.39,10.29 31,12.68 v31,16.8 | v21,43.6 12,43.6 11,43 11,42.45 K1.2
N$20
  Bottom 0.254: IC4.25 58.26,19.4 56.39,17.53 R10.2
  Bottom 0.305: 56.35,13.66 R10.2
N$21
  Bottom 1.27: CON2.P$1 14.94,6.67 F1.2
N$22
  Bottom 0.305: CON1.11 83,40.5 81.5,40.5 80.2,39.2 R11.2 R12.2
N$23
  Bottom 1.27: K1.8 8.18,31.82 CON2.P$4
  Bottom 1.422: M1.2 13.19,24.81 9,29 5.69,29 CON2.P$4
N$25
  Bottom 0.406: IC4.26 60.62,18.76 62.23,17.15 62.23,10.27 64.64,7.86 IC5.3 | 66.7,7.84 IC5.3 | IC5.3 IC5.2
N$26
  Bottom 1.422: CON2.P$3 CON2.P$2 5.69,14 8.17,14 M1.1 16.37,17.19 U$2.2
N$27
  Bottom 0.406: D4.3 77.1,28.6
  Bottom 0.61: IC6.7 73.21,29.49 D4.3 | 77.1,28.6 78.1,28.6 CON1.9
N$28
  Bottom 0.406: ICD.1 50.65,6.58 51.94,7.88 51.94,17.4 IC4.1
N$29
  Bottom 0.406: D5.3 77.5,32
  Bottom 0.61: IC6.5 73.87,32.03 D5.3 | 77.5,32 82.5,37 83,37 CON1.10
N$30
  Bottom 0.406: C4.1 31.59,38.23 IC1.1
N$32
  Bottom 1.016: R19.1 54.39,40.89 54.5,41 | R20.2 50.28,40.78 50.5,41 52.5,41 | 52.5,41 54.5,41 | 54.5,41 56,41 56.42,40.58 R14.1 | R21.2 52.31,40.81 52.5,41
N$33
  Bottom 0.305: R1.2 78.15,24.15 78.5,24.5 78.5,25.5 CON1.8
N$34
  Bottom 0.305: CON1.6 82.56,23.06 78.85,19.35 R15.2
N$35
  Bottom 0.305: CON1.7 82.54,26.56 78.63,22.65 R18.2
N$36
  Bottom 0.406: IC7.2 42.05,43.06 41.15,42.16 40.77,42.16 C9.1
N$37
  Bottom 0.254: IC4.4 49.72,19.4 IC3.2
N$38
  Bottom 0.406: IC7.4 41.41,45.6 C9.2
N$40  (via drill 0.5)
  Top 0.305: v30.1,36 28,36 v26,39.9
  Bottom 0.254: R17.2 25.9,40 v26,39.9 25.9,39.8 R9.1
  Bottom 0.305: IC1.3 30.95,36.05 v30.1,36 | 25.6,41.18 R17.2
N$41
  Bottom 0.61: 29.79,40.91 29.7,41 29.7,41.28 L1.2 30.17,41.64
  pour Bottom (no thermals): 28,43 34.6,43 34.6,40.8 30.5,40.8 30.5,38.6 29.4,37.6 28,37.6
RS485_A
  Bottom 0.254: 71.78,7.84 73.01,7.84 74.05,6.8 77.27,6.8 78.52,5.56 CON1.1
  Bottom 0.406: IC5.6 71.77,7.86 71.78,7.84
RS485_B
  Bottom 0.254: IC5.7 72.97,6.58 73.4,6.15 73.4,4.85 74,4.25 77.31,4.25 77.89,3.67 83.67,3.67 84.5,4.5 84.5,7 83.06,8.44 CON1.2
RX
  Top 0.406: ICD.4 58.35,3.94 58.35,5.7 60.73,8.08 FTDI.3
  Bottom 0.406: IC4.28 59.14,6.49 58.35,5.7 58.35,3.94 ICD.4
TX
  Top 0.406: ICD.5 60.76,3.9 60.76,5 61.76,6 73,6 73.46,5.54 FTDI.2
  Bottom 0.406: IC4.27 60.3,18.1 60.76,17.64 60.76,3.9 ICD.5
VCC  (via drill 0.5)
  Top 0.406: v63.7,21.23 v63.7,18.7 | FTDI.5 73.84,13.16 73.2,13.8 v73.2,16.5
  Top 0.61: v47.77,14.95 v55.43,14.95 55.45,14.95 59.53,19.04 59.53,21 | v71.3,3.19 69.58,1.47 54.15,1.47 53.16,2.45 53.16,3.83 ICD.2 | 59.53,21 59.53,27.2 64.75,32.41 v64.75,36.27 65,36.31 65,42 64,43 49,43 47,41 45,41 38.76,47.24 v37.46,47.24 | v63.7,21.23 59.77,21.23 59.53,21
  Bottom 0.254: 31.86,44.96 26.96,44.96 26,44 R17.1 | 35.54,44.95 C7.2 C15.2
  Bottom 0.305: 47.36,18.69 IC3.1 | v63.7,18.7 65.8,18.7 67.95,16.55 D8.2
  Bottom 0.406: IC4.20 60.65,22.65 61.25,22.05 61.95,22.05 C11.1 62.77,21.23 v63.7,21.23 65.4,21.23 66.12,21.95 D9.2 68.95,21.95 70.5,23.5 71.05,23.5 D3.2 71.45,23.5 71,23.5 | ICD.2 53.19,4.67 | 71.78,4.66 71.78,5.17 IC5.8 | R12.1 72.39,36.32 | 72.39,36.32 72.64,36.07 74.15,36.07 D2.2 | 72.39,36.32 72.14,36.07 64.95,36.07 v64.75,36.27 | v47.77,14.95 47.5,15.22 47.5,17.78 47.62,17.9 IC3.1 47.47,18.8 45.5,18.8 C5.1 45.29,18.81 43.25,18.81 R23.2 R22.2 | 41.73,18.81 R22.2 | 41.71,18.94 R22.2 | 47.36,18.69 47.39,18.69 47.5,18.8 | v64.75,36.27 64.13,36.27 63.5,36.9 R5.1 62.21,37.5 R3.1 | 64.79,36.3 v64.75,36.27 | v73.2,16.5 71.15,16.5 D8.2
  Bottom 0.61: IC5.8 71.64,3.53 v71.3,3.19 71.16,3.05 C10.1 | CON3.10 47.77,14.94 v47.77,14.95 49.32,14.95 49.91,14.35 C3.1 | C15.2 31.97,44.74 v37.46,47.24 | v55.43,14.95 54.48,13.99 54.48,6.84 53.32,5.67 53.32,4.81 53.19,4.67
  pour Bottom (no thermals): 28.18,43.94 28.18,48.02 39.12,48.02 39.12,43.94

### Text on the board
tPlace: V2.2 | RCM - 12V GND | CON2 | C:/projects/EVSE/SmartEvse_logo.bmp
tNames: EV | LOCK | I/O | BLK | 3V | ICD | FTDI | ^
bNames: PE | CP | * | * | PP | W | R | Contactor | CAUTION, HIGH VOLTAGE ! | B | RCM | SW | LED | N | GND | +12V | B | L | A